# EAGLE board EBookReader (EAGLE 9.7.0)
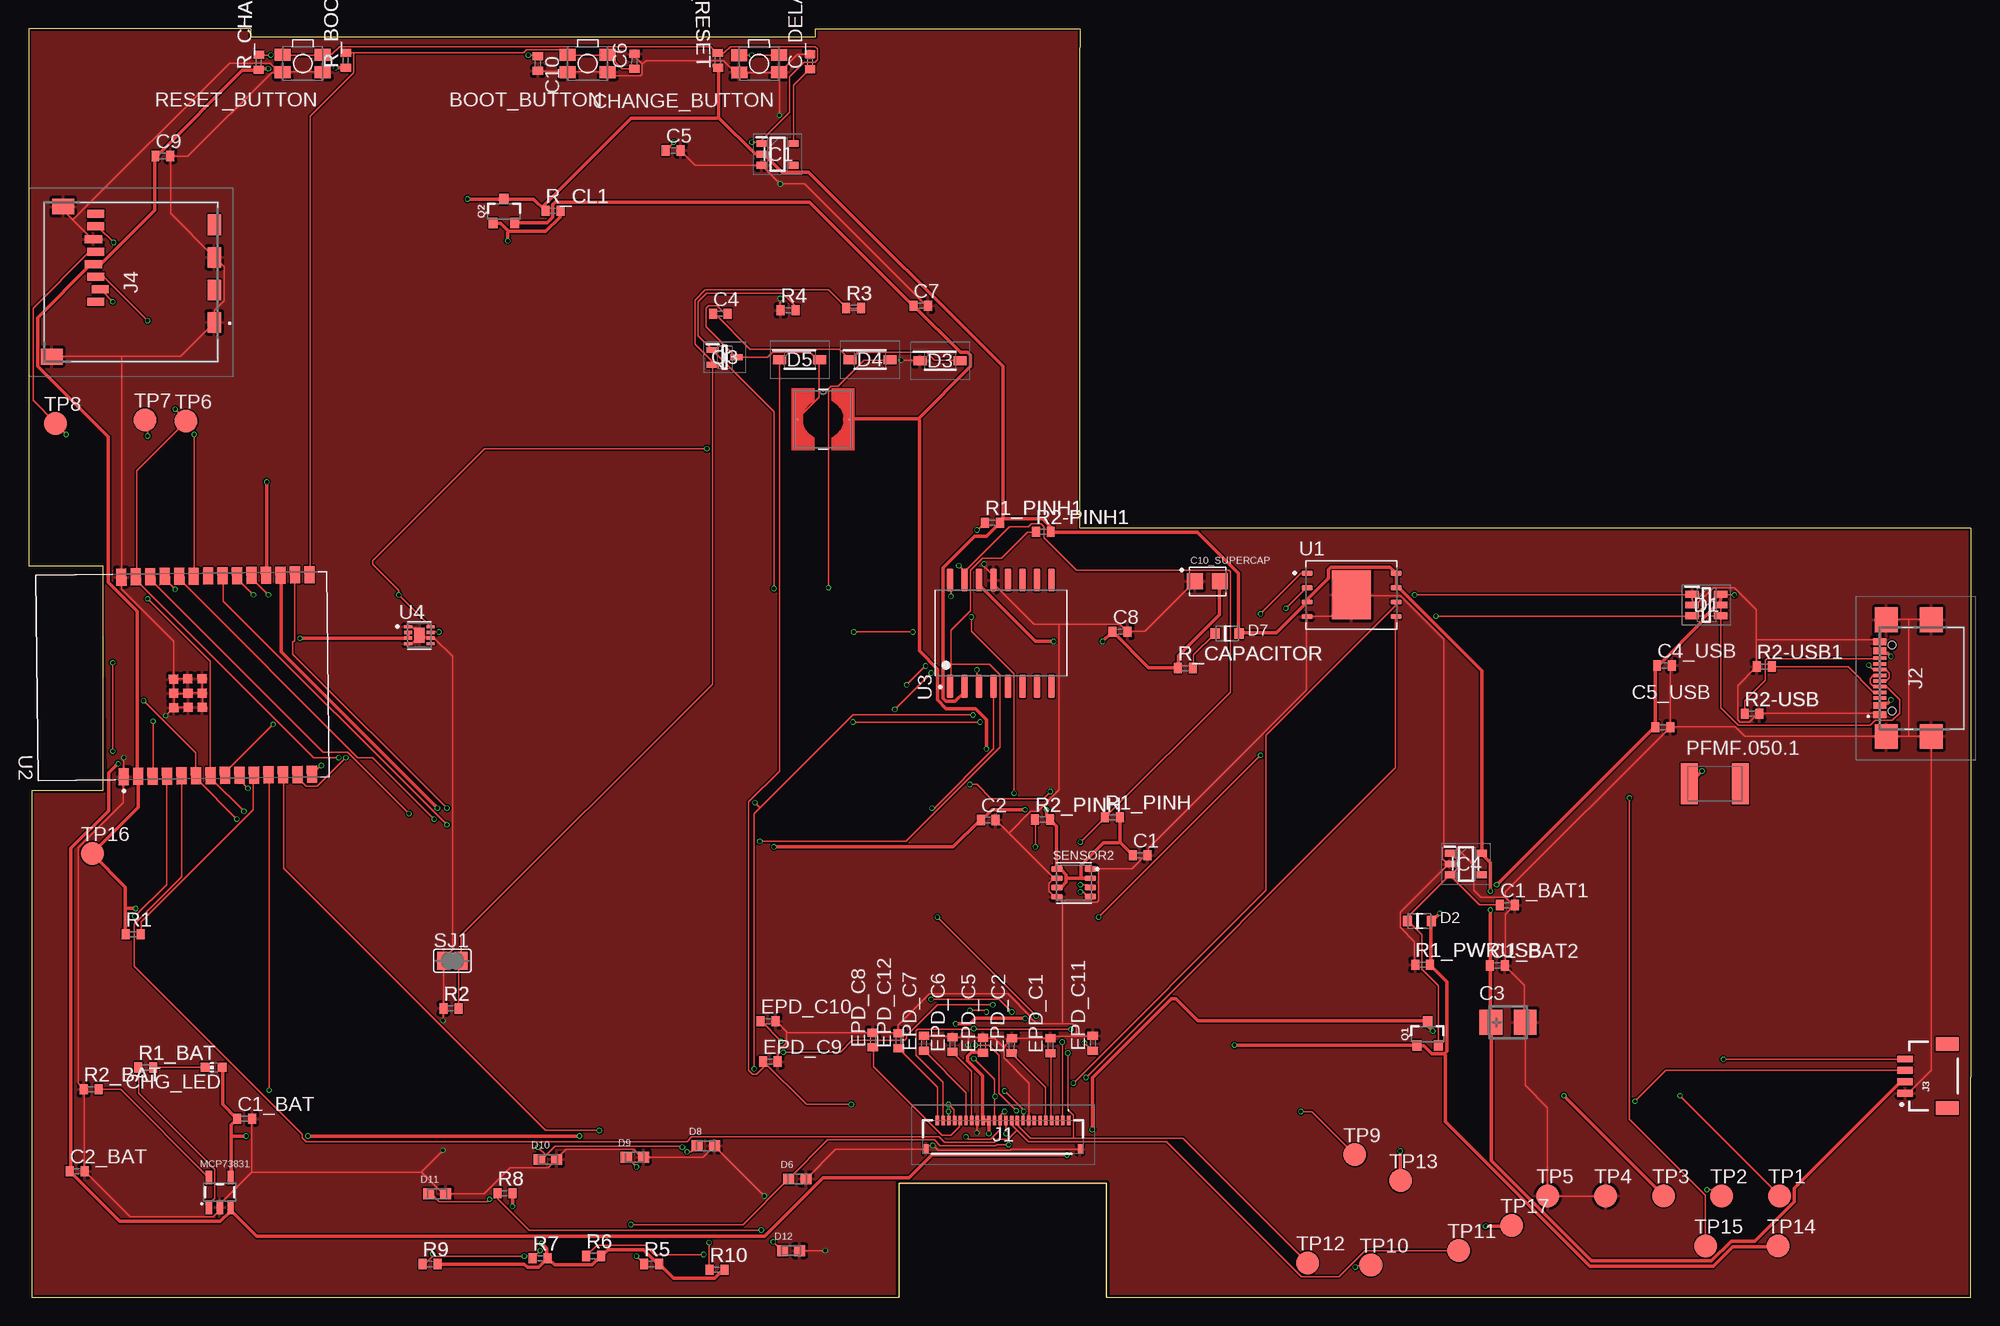
[diagram p1: board, top side]
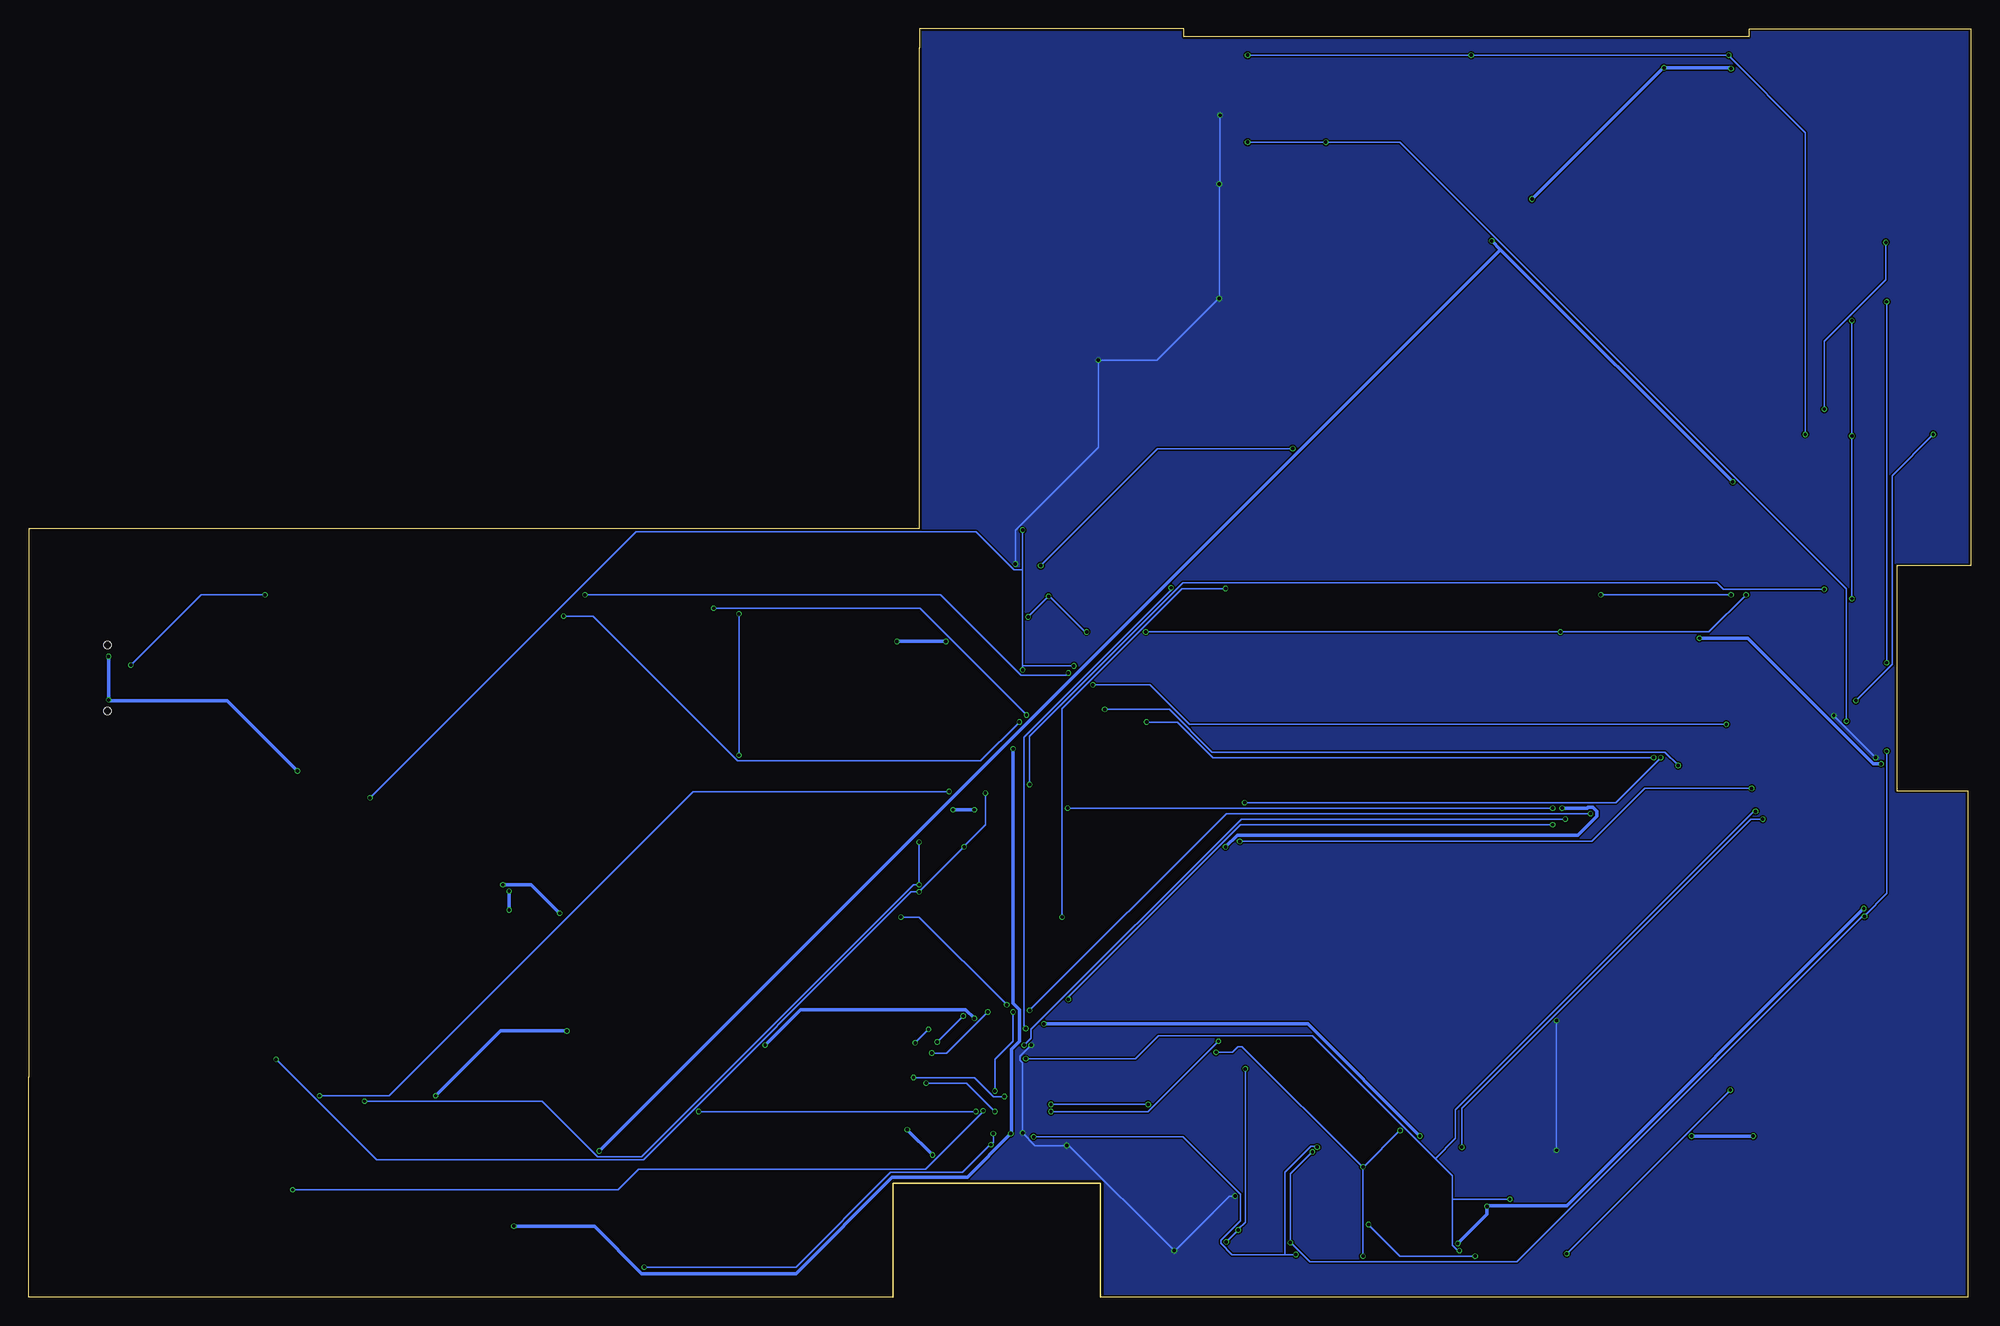
[diagram p2: board, bottom side, seen from below]

Size 170.3 x 111.2 mm. Coordinates in mm from the lower left corner, seen from the top.
Outline: 170.3,0 170.3,19.3 170.3,67.4 92.2,67.4 92.2,109.5 92.2,111.2 69,111.2 69,110.5 19.5,110.5 19.5,111.2 0,111.2 0,64.1 6.5,64.1 6.5,44.4 0.3,44.4 0.3,0 76.3,0 76.3,10 94.5,10 94.5,0 170.3,0
Copper layers (1*16): Top 0.035mm / dielectric 1.6mm / Bottom 0.035mm
Design rules "jlcpcb-2layers.dru": minimum track width 5mil, minimum drill 0.3mm, track to track 5mil, track to pad 5mil, pad to pad 5mil, via to via 5mil, smd to smd 5mil, copper to edge 0.2mm, drill to drill 6mil, minimum pad ring 10mil, minimum via ring 3mil, stop-mask expansion 4mil, vias tented up to drill 0mil, thermal gap 10mil
Net classes: 0 default: width 0.15 mm; 1 power: width 0.3 mm

## Footprints (pad centres in the part's own frame; a part is rotated, then mirrored left to right if it is on the bottom)
MYBUTTON = smd 1.4 x 1.05: 1 1.75,0.75; 2 -1.75,0.75; 3 -1.75,-0.75; 4 1.75,-0.75
EAGLE-LTSPICE_C0402 = smd 0.7 x 0.9: 1 -0.65,0; 2 0.65,0
RCL_CT3528 = smd 2 x 2.2: + -1.5,0; - 1.5,0
CAPCP3225X100N = smd 1.4 x 1.4: 1 -1.1,0; 2 1.1,0
ADAFRUIT_CHIP-LED0603 = smd 0.8 x 0.8: A 0,-0.75; C 0,0.75
SOT95P280X145-6N = smd 1.2 x 0.6: 1 -1.25,0.95; 2 -1.25,0; 3 -1.25,-0.95; 4 1.25,-0.95; 5 1.25,0; 6 1.25,0.95
ESP32_WROVER_AVX---SD0805S020S1R0_AVX_SD0805S020S1R0_0 = smd 0.8 x 0.9: 1 -1.05,0; 2 1.05,0
SOD3716X135N = smd 1.15 x 0.8: 1 -1.75,0; 2 1.75,0
DIOC1608X36N = smd 0.97 x 0.94: 1 -0.75,0; 2 0.75,0
SOT95P280X125-5N = smd 0.9 x 0.6: 1 -1.4,0.95; 2 -1.4,0; 3 -1.4,-0.95; 4 1.4,-0.95; 5 1.4,0.95
SOT95P280X120-5N = smd 0.9 x 0.6: 1 -1.4,0.95; 2 -1.4,0; 3 -1.4,-0.95; 4 1.4,-0.95; 5 1.4,0.95
FH34SRJ24S05SH99 = smd 0.3 x 0.8: 1 5.75,1.45; 2 5.25,1.45; 3 4.75,1.45; 4 4.25,1.45; 5 3.75,1.45; 6 3.25,1.45; 7 2.75,1.45; 8 2.25,1.45; 9 1.75,1.45; 10 1.25,1.45; 11 0.75,1.45; 12 0.25,1.45; 13 -0.25,1.45; 14 -0.75,1.45; 15 -1.25,1.45; 16 -1.75,1.45; 17 -2.25,1.45; 18 -2.75,1.45; 19 -3.25,1.45; 20 -3.75,1.45; 21 -4.25,1.45; 22 -4.75,1.45; 23 -5.25,1.45; 24 -5.75,1.45 | smd 0.4 x 0.8: MP1 6.75,-1.05; MP2 -6.75,-1.05
SAMACSYS_PARTS_USB4110GFA = smd 0.3 x 1.15: A1 -3.35,3.678; A4 -2.55,3.678; A5 -1.25,3.678; A6 -0.25,3.678; A7 0.25,3.678; A8 1.25,3.678; A9 2.55,3.678; A12 3.35,3.678; B1 3.05,3.678; B4 2.25,3.678; B5 1.75,3.678; B6 0.75,3.678; B7 -0.75,3.678; B8 -1.75,3.678; B9 -2.25,3.678; B12 -3.05,3.678 | smd 2.18 x 2: MP1 -5.11,-0.827; MP2 5.11,-0.827; MP3 -5.11,3.103; MP4 5.11,3.103 | hole 0.65: -2.89,2.603; 2.89,2.603
JST04_1MM_RA = smd 0.6 x 1.35: 1 -1.5,0; 2 -0.5,0; 3 0.5,0; 4 1.5,0 | smd 1.2 x 2: NC1 2.8,-3.675; NC2 -2.8,-3.675
112ATAARR03ATTEND = smd 1.8 x 1.2: G1 10.6,10.4; G2 4.9,10.4; S1 7.75,10.4; S2 2.05,10.4 | smd 1.4 x 1.9: G3 13.6,-3.85; G4 0.45,-2.85 | smd 0.7 x 1.5: P1 8.8,0; P2 7.7,0.4; P3 6.6,0; P4 5.5,-0.2; P5 4.4,0; P6 3.3,-0.2; P7 2.2,0; P8 1.1,0
IND_4828-WE-TPC_WRE = smd 0.127 x 0.127: 1 -2.286,0; 2 2.286,0
ESP32_WROVER_SPARKFUN-IC-POWER_SOT23-5 = smd 0.55 x 1.2: 1 -0.95,-1.3; 2 0,-1.3; 3 0.95,-1.3; 4 0.95,1.3; 5 -0.95,1.3
ESP32C6_VARISTOR_CT/CN1812 = smd 1.5 x 3.6: 1 -2.25,0; 2 2.25,0
ESP32_WROVER_SPARKFUN-DISCRETESEMI_SOT23-3 = smd 0.8 x 0.9: 1 -0.95,-1; 2 0.95,-1; 3 0,1.1
SOT65P210X110-3N = smd 1.05 x 0.5: 1 -1.05,0.65; 2 -1.05,-0.65; 3 1.05,0
ESP32_WROVER_EAGLE-LTSPICE_R0402 = smd 0.7 x 0.9: 1 -0.65,0; 2 0.65,0
ESP32_WROVER_BME680_PSON80P300X300X100-8N = smd 1.016 x 0.5: 1 1.458,1.2; 2 1.458,0.4; 3 1.458,-0.4; 4 1.458,-1.2; 5 -1.458,-1.22; 6 -1.458,-0.4; 7 -1.458,0.4; 8 -1.458,1.2
SJ = smd 1.168 x 1.6: 1 -0.762,0; 2 0.762,0
TP20R = smd 2 x 2: TP 0,0
SON127P600X800X80-9N = smd 0.94 x 0.44: 1 -3.895,1.905; 2 -3.895,0.635; 3 -3.895,-0.635; 4 -3.895,-1.905; 5 3.895,-1.905; 6 3.895,-0.635; 7 3.895,0.635; 8 3.895,1.905 | smd 3.4 x 4.3: 9 0,0
XCVR_ESP32-C6-WROOM-1-N8 = smd 1.5 x 0.9: 1 -8.75,5.26; 2 -8.75,3.99; 3 -8.75,2.72; 4 -8.75,1.45; 5 -8.75,0.18; 6 -8.75,-1.09; 7 -8.75,-2.36; 8 -8.75,-3.63; 9 -8.75,-4.9; 10 -8.75,-6.17; 11 -8.75,-7.44; 12 -8.75,-8.71; 13 -8.75,-9.98; 14 -8.75,-11.25; 15 8.75,-11.25; 16 8.75,-9.98; 17 8.75,-8.71; 18 8.75,-7.44; 19 8.75,-6.17; 20 8.75,-4.9; 21 8.75,-3.63; 22 8.75,-2.36; 23 8.75,-1.09; 24 8.75,0.18; 25 8.75,1.45; 26 8.75,2.72; 27 8.75,3.99; 28 8.75,5.26 | smd 0.8 x 0.8: 29_1 -2.755,0.79; 29_2 -1.505,0.79; 29_3 -0.255,0.79; 29_4 -2.755,-0.46; 29_5 -1.505,-0.46; 29_6 -0.255,-0.46; 29_7 -2.755,-1.71; 29_8 -1.505,-1.71; 29_9 -0.255,-1.71
SOIC127P1032X265-16N = smd 2.05 x 0.59: 1 -4.655,4.445; 2 -4.655,3.175; 3 -4.655,1.905; 4 -4.655,0.635; 5 -4.655,-0.635; 6 -4.655,-1.905; 7 -4.655,-3.175; 8 -4.655,-4.445; 9 4.655,-4.445; 10 4.655,-3.175; 11 4.655,-1.905; 12 4.655,-0.635; 13 4.655,0.635; 14 4.655,1.905; 15 4.655,3.175; 16 4.655,4.445
SON50P200X200X80-9N = smd 0.76 x 0.27: 1 -0.985,0.75; 2 -0.985,0.25; 3 -0.985,-0.25; 4 -0.985,-0.75; 5 0.985,-0.75; 6 0.985,-0.25; 7 0.985,0.25; 8 0.985,0.75 | smd 0.9 x 1.3: 9 0,0

## Placement (x,y rotation side)
BOOT_BUTTON  BUTTON_CUSYOMV1  [MYBUTTON]  49.03,108.13 180 top
C1  100nF  [EAGLE-LTSPICE_C0402]  97.46,38.73 0 top
C1_BAT  4.7uF  [EAGLE-LTSPICE_C0402]  18.95,15.65 0 top
C1_BAT1  4.7uF  [EAGLE-LTSPICE_C0402]  129.65,34.37 0 top
C1_BAT2  4.7uF  [EAGLE-LTSPICE_C0402]  128.79,29.07 0 top
C2  100nF  [EAGLE-LTSPICE_C0402]  84.14,41.83 0 top
C2_BAT  4.7uF  [EAGLE-LTSPICE_C0402]  4.26,11.05 0 top
C3  100uF TANT  [RCL_CT3528]  129.71,24.1 0 top
C4  4.7uF/25V  [EAGLE-LTSPICE_C0402]  60.65,86.19 0 top
C4_USB  100nF  [EAGLE-LTSPICE_C0402]  143.43,55.37 0 top
C5  1uF  [EAGLE-LTSPICE_C0402]  56.52,100.51 0 top
C5_USB  4.7uF  [EAGLE-LTSPICE_C0402]  143.28,49.95 0 top
C6  100nF  [EAGLE-LTSPICE_C0402]  53.12,108.33 89.5 top
C7  10uF  [EAGLE-LTSPICE_C0402]  78.22,86.91 0 top
C8  100nF  [EAGLE-LTSPICE_C0402]  95.7,58.33 0 top
C9  100nF  [EAGLE-LTSPICE_C0402]  11.78,100.03 0 top
C10  100nF  [EAGLE-LTSPICE_C0402]  44.66,108.13 270 top
C10_SUPERCAP  CPH3225A  [CAPCP3225X100N]  103.36,62.74 0 top
C_DELAY  100nF  [EAGLE-LTSPICE_C0402]  68.51,108.29 90 top
CHANGE_BUTTON  BUTTON_CUSYOMV1  [MYBUTTON]  64.06,108.11 180.5 top
CHG_LED  [ADAFRUIT_CHIP-LED0603]  16.24,20.15 90 top
D1  USBLC6-2SC6Y  [SOT95P280X145-6N]  147.1,60.67 0 top
D2  ESP32_WROVER_AVX---SD0805S020S1R0_AVX_SD0805S020S1R0_0_0AVX_SD0805S020S1R0_0_0  [ESP32_WROVER_AVX---SD0805S020S1R0_AVX_SD0805S020S1R0_0]  121.94,32.98 0 top
D3  MBR0530  [SOD3716X135N]  79.93,82.08 0 top
D4  MBR0530  [SOD3716X135N]  73.77,82.18 0 top
D5  MBR0530  [SOD3716X135N]  67.61,82.18 0 top
D6  PGB1010603MR  [DIOC1608X36N]  67.4,10.37 0 top
D7  ESP32_WROVER_AVX---SD0805S020S1R0_AVX_SD0805S020S1R0_0_0AVX_SD0805S020S1R0_0_0  [ESP32_WROVER_AVX---SD0805S020S1R0_AVX_SD0805S020S1R0_0]  105.09,58.18 0 top
D8  PGB1010603MR  [DIOC1608X36N]  59.38,13.27 0 top
D9  PGB1010603MR  [DIOC1608X36N]  53.16,12.27 0 top
D10  PGB1010603MR  [DIOC1608X36N]  45.54,12.07 0 top
D11  PGB1010603MR  [DIOC1608X36N]  35.82,9.07 0 top
D12  PGB1010603MR  [DIOC1608X36N]  66.85,4.08 0 top
EPD_C1  1uF/50V  [EAGLE-LTSPICE_C0402]  89.59,22.05 90 top
EPD_C2  1uF/50V  [EAGLE-LTSPICE_C0402]  86.2,22.05 88.9 top
EPD_C5  0.1uF/50V  [EAGLE-LTSPICE_C0402]  83.69,22.09 90 top
EPD_C6  1uF/50V  [EAGLE-LTSPICE_C0402]  81.01,22.15 90 top
EPD_C7  1uF/50V  [EAGLE-LTSPICE_C0402]  78.52,22.25 90 top
EPD_C8  1uF/50V  [EAGLE-LTSPICE_C0402]  74.03,22.55 90 top
EPD_C9  1uF/50V  [EAGLE-LTSPICE_C0402]  65.04,20.65 0 top
EPD_C10  1uF/50V  [EAGLE-LTSPICE_C0402]  64.85,24.19 0 top
EPD_C11  1uF/50V  [EAGLE-LTSPICE_C0402]  93.31,22.27 90 top
EPD_C12  1uF/50V  [EAGLE-LTSPICE_C0402]  76.29,22.49 90 top
IC1  BD5229G-TR  [SOT95P280X125-5N]  65.67,100.17 0 top
IC4  XC6220A331MR-G  [SOT95P280X120-5N]  126.01,37.97 0 top
J1  FH34SRJ-24S-0.5SH_99_  [FH34SRJ24S05SH99]  85.44,14.04 0 top
J2  SAMACSYS_PARTS_USB4110-GF-A  [SAMACSYS_PARTS_USB4110GFA]  165.98,54.26 90 top
J3  QWIIC_RIGHT_ANGLE  [JST04_1MM_RA]  164.53,19.38 90 top
J4  112A-TAAR-R03_ATTEND  [112ATAARR03ATTEND]  5.89,96.05 270 top
L1  68uH  [IND_4828-WE-TPC_WRE]  69.67,76.95 0 top
MCP73831  ESP32_WROVER_SPARKFUN-IC-POWER_MCP73831  [ESP32_WROVER_SPARKFUN-IC-POWER_SOT23-5]  16.78,9.19 0 top
PFMF.050.1  ESP32C6_VARISTORCN1812  [ESP32C6_VARISTOR_CT/CN1812]  147.84,45 0 top
Q1  20V/4.2A/52mΩ/1.4W  [ESP32_WROVER_SPARKFUN-DISCRETESEMI_SOT23-3]  122.66,23.06 0 top
Q2  20V/4.2A/52mΩ/1.4W  [ESP32_WROVER_SPARKFUN-DISCRETESEMI_SOT23-3]  41.68,95.16 0 top
Q3  SI1308EDL-T1-GE3  [SOT65P210X110-3N]  61.04,82.38 0 top
R1  10K  [ESP32_WROVER_EAGLE-LTSPICE_R0402]  9.18,31.81 0 top
R1_BAT  200  [ESP32_WROVER_EAGLE-LTSPICE_R0402]  10.28,20.13 0 top
R1_PINH  10K  [ESP32_WROVER_EAGLE-LTSPICE_R0402]  95.03,42.07 0 top
R1_PINH1  10K  [ESP32_WROVER_EAGLE-LTSPICE_R0402]  84.51,67.89 0 top
R1_PWRUSB  100K  [ESP32_WROVER_EAGLE-LTSPICE_R0402]  122.22,29.14 0 top
R2  2.2  [ESP32_WROVER_EAGLE-LTSPICE_R0402]  37.04,25.31 0 top
R2-PINH1  10K  [ESP32_WROVER_EAGLE-LTSPICE_R0402]  88.97,67.09 0 top
R2-USB  5K1  [ESP32_WROVER_EAGLE-LTSPICE_R0402]  151.1,51.13 0 top
R2-USB1  5K1  [ESP32_WROVER_EAGLE-LTSPICE_R0402]  152.17,55.27 0 top
R2_BAT  2K  [ESP32_WROVER_EAGLE-LTSPICE_R0402]  5.49,18.23 0 top
R2_PINH  10K  [ESP32_WROVER_EAGLE-LTSPICE_R0402]  88.91,41.87 0 top
R3  0.47  [ESP32_WROVER_EAGLE-LTSPICE_R0402]  72.34,86.71 0 top
R4  10K  [ESP32_WROVER_EAGLE-LTSPICE_R0402]  66.6,86.51 0 top
R5  10K  [ESP32_WROVER_EAGLE-LTSPICE_R0402]  54.62,2.91 0 top
R6  10K  [ESP32_WROVER_EAGLE-LTSPICE_R0402]  49.54,3.61 0 top
R7  10K  [ESP32_WROVER_EAGLE-LTSPICE_R0402]  44.86,3.41 0 top
R8  10K  [ESP32_WROVER_EAGLE-LTSPICE_R0402]  41.78,9.11 0 top
R9  10K  [ESP32_WROVER_EAGLE-LTSPICE_R0402]  35.2,2.91 0 top
R10  10K  [ESP32_WROVER_EAGLE-LTSPICE_R0402]  60.36,2.41 0 top
R_BOOT  10K  [ESP32_WROVER_EAGLE-LTSPICE_R0402]  27.82,108.41 90 top
R_CAPACITOR  15  [ESP32_WROVER_EAGLE-LTSPICE_R0402]  101.42,55.14 0 top
R_CHANGE  10K  [ESP32_WROVER_EAGLE-LTSPICE_R0402]  20.19,108.24 88.9 top
R_CL1  10K  [ESP32_WROVER_EAGLE-LTSPICE_R0402]  45.98,95.23 0 top
R_RESET  10K  [ESP32_WROVER_EAGLE-LTSPICE_R0402]  60.43,108.4 91.1 top
RESET_BUTTON  BUTTON_CUSYOMV1  [MYBUTTON]  24.05,108.13 180 top
SENSOR2  ESP32_WROVER_BME680_BME680  [ESP32_WROVER_BME680_PSON80P300X300X100-8N]  91.64,36.32 0 top
SJ1  [SJ]  37.16,29.49 0 top
TP1  TPTP20R  [TP20R]  153.51,8.89 0 top
TP2  TPTP20R  [TP20R]  148.43,8.89 0 top
TP3  TPTP20R  [TP20R]  143.35,8.89 0 top
TP4  TPTP20R  [TP20R]  138.27,8.89 0 top
TP5  TPTP20R  [TP20R]  133.19,8.89 0 top
TP6  TPTP20R  [TP20R]  13.81,76.79 0 top
TP7  TPTP20R  [TP20R]  10.23,76.89 0 top
TP8  TPTP20R  [TP20R]  2.35,76.59 0 top
TP9  TPTP20R  [TP20R]  116.27,12.49 0 top
TP10  TPTP20R  [TP20R]  117.69,2.81 0 top
TP11  TPTP20R  [TP20R]  125.39,4.09 0 top
TP12  TPTP20R  [TP20R]  112.14,3.01 0 top
TP13  TPTP20R  [TP20R]  120.29,10.21 0 top
TP14  TPTP20R  [TP20R]  153.39,4.49 0 top
TP15  TPTP20R  [TP20R]  147.04,4.49 0 top
TP16  TPTP20R  [TP20R]  5.59,38.89 0 top
TP17  TPTP20R  [TP20R]  130.04,6.29 0 top
U1  W25Q512JVEIQ  [SON127P600X800X80-9N]  115.99,61.56 0 top
U2  ESP32-C6-WROOM-1-N8  [XCVR_ESP32-C6-WROOM-1-N8]  13.5,54.44 90.7 top
U3  DS3231SN#  [SOIC127P1032X265-16N]  85.25,58.2 90 top
U4  MAX17048G+T10  [SON50P200X200X80-9N]  34.27,58.02 0 top

## Tracks (layer width: path | path; a pad name or v marks a point on that pad's centre or on a via)
3V3  (via drill 0.3)
  Top 0.3: J3.2 164.52,18.84 164.1,18.84 154.83,9.56 154.83,8.38 151.36,4.92 149.29,4.92 147.55,3.19 137.03,3.19 128.23,11.98 128.23,23.96 C3.+ 128.16,24.17 128.16,29.02 C1_BAT2.1 128.16,29.15 v128.16,33.93 | 85.51,68.21 88.9,68.21 89.59,67.52 89.59,67.1 R2-PINH1.2 89.73,67.03 102.47,67.03 106.07,63.43 106.07,58.38 D7.2 106.14,58.24 109.4,58.24 112.03,60.87 U1.3 112.17,61.01 112.17,61.22 113.97,63.02 113.97,63.78 114.17,63.99 119.37,63.99 119.78,63.57 U1.8 119.92,63.43 119.92,62.33 U1.7 119.92,62.19 120.13,62.19 127.4,54.91 127.4,38.99 IC4.5 127.47,38.78 128.16,38.09 v128.16,35.59 | 85.51,68.21 85.23,67.93 R1_PINH1.2 85.09,67.8 83.98,66.69 82.94,66.69 80.17,63.92 80.17,52.49 80.45,52.22 81.21,52.22 82.04,53.05 82.04,53.53 U3.2 | 60.51,103.39 63.69,100.2 64.25,100.2 IC1.2 64.38,100.27 66.05,98.61 68.4,98.61 85.44,81.58 85.44,68.35 85.51,68.21 | 60.51,103.39 60.51,107.68 R_RESET.1 | 60.51,103.39 60.37,103.32 52.82,103.32 45.13,95.63 R_CL1.1 45.27,95.29 44.3,96.26 41.74,96.26 Q2.3 41.53,96.26 v38.48,96.26 | R9.2 43.47,2.91 43.75,2.63 44.72,2.63 45.48,3.39 R7.2 | v42.43,7.96 42.43,9.07 R8.2 | v44.99,4.71 45.41,4.29 45.41,3.53 R7.2 | R7.2 45.62,3.32 46.1,2.84 49.43,2.84 R6.2 50.33,3.67 50.81,4.16 53.93,4.16 55.11,2.98 55.24,2.98 R5.2 55.38,2.84 56.56,1.66 60.16,1.66 60.85,2.35 60.99,2.35 R10.2 | 8.5,34.07 8.5,35.94 5.59,38.85 TP16.TP 5.66,38.99 9.61,42.94 9.61,45.64 U2.2 9.54,45.77 9.54,60.11 6.98,62.67 6.98,75.41 0.81,81.58 0.81,85.87 5.38,90.44 5.59,90.44 J4.P4 5.73,90.58 6.35,90.58 11.06,95.29 11.06,100 C9.1 11.27,100.07 18.75,107.55 20.13,107.55 R_CHANGE.1 20.27,107.68 v21.03,107.68
  Top 0.3: 8.5,34.07 8.5,31.86 R1.1 | v26.92,107.75 27.75,107.75 R_BOOT.1 | 8.5,34.07 v9.4,34.07
  Bottom 0.3: v128.16,35.59 v128.16,33.93 | v44.99,4.71 42.43,7.27 v42.43,7.96 42.29,8.03 35.44,8.03 v9.4,34.07 | v21.03,107.68 21.1,107.75 v26.92,107.75 27.06,107.68 v38.48,96.26
32KHZ  (via drill 0.3)
  Top 0.15: 80.87,55.47 80.87,53.6 U3.1 | 80.87,55.47 80.87,58.45 82.6,60.18 82.6,63.71 83.64,64.75 85.3,64.75 87.58,67.03 88.27,67.03 R2-PINH1.1 | v19.23,44.6 18.54,45.29 18.54,45.7 U2.9 | v64.11,39.96 76.92,39.96 85.16,48.2 85.16,54.57 84.26,55.47 80.87,55.47
  Bottom 0.15: v19.23,44.6 28.58,44.6 33.22,39.96 v64.11,39.96
DN
  Top 0.15: J2.A7 162.24,54.5 161.75,54.5 161.47,54.22 161.47,53.81 161.75,53.53 162.24,53.53 J2.B7 162.37,53.53 162.86,53.53 164.04,52.35 164.04,51.18 163.41,50.55 161.89,50.55 161.47,50.14 149.91,50.14 148.38,51.66 148.38,59.69 D1.5
DP  (via drill 0.3)
  Top 0.15: J2.A6 162.86,54.02 163.14,54.29 163.14,54.71 162.86,54.98 162.3,54.98 J2.B6 162.24,55.05 161.68,55.05 v161.33,55.4 | v149.56,61.56 148.38,61.56 D1.3
  Bottom 0.15: v149.56,61.56 155.17,61.56 v161.33,55.4
EPD_3V3  (via drill 0.3)
  Top 0.3: 78.03,77.01 82.6,81.58 82.6,82.55 82.32,82.82 81.7,82.82 77.61,86.91 C7.1 77.47,86.98 68.47,95.98 46.17,95.98 45.96,95.77 45.96,94.67 45.48,94.18 42.64,94.18 Q2.2 | 78.03,77.01 72,77.01 L1.2 | EPD_C5.1 83.64,21.47 82.67,21.47 82.32,21.12 82.32,20.71 83.64,19.39 83.64,15.65 J1.16 83.7,15.51 84.19,15.51 J1.15 84.19,15.37 v84.19,14.34 | v127.75,6.23 130.03,6.23 TP17.TP | v83.98,48.06 83.98,50.62 83.01,51.59 80.45,51.59 79.69,52.35 79.69,55.05 78.1,56.65 78.1,76.87 78.03,77.01
  Bottom 0.3: v127.75,6.23 120.69,6.23 116.53,2.08 103.03,2.08 94.58,10.53 88,10.53 v84.19,14.34 84.12,14.47 84.12,21.74 83.43,22.44 83.43,25.21 83.98,25.76 v83.98,48.06
EPD_3V3_C  (via drill 0.3)
  Top 0.3: 42.09,93.42 41.39,94.11 40.77,94.11 Q2.1 | 42.09,93.42 45.34,93.42 46.59,94.67 46.59,95.22 R_CL1.2 | v20.9,71.47 20.9,63.29 U2.18 | v42.02,92.59 42.02,93.28 42.09,93.42 | v120.27,12.81 120.27,10.25 TP13.TP
  Bottom 0.3: v42.02,92.59 41.25,91.83 | 41.25,91.83 v20.9,71.47 | 41.25,91.83 v120.27,12.81
EPD_BUSY  (via drill 0.3)
  Top 0.15: v111.54,16.27 112.51,16.27 116.25,12.53 TP9.TP | J1.9 87.24,15.51 v87.24,16.27 87.24,16.41 v85.58,18.07 | v33.36,42.38 27.96,47.78 25.81,47.78 10.71,62.88 10.71,63.16 U2.26 | v82.53,25.14 83.84,25.14 v83.98,25
  Bottom 0.15: v111.54,16.27 v87.24,16.27 | v33.36,42.38 65.28,42.38 v82.53,25.14 | v83.98,25 83.98,22.44 85.58,20.84 v85.58,18.07
EPD_CS  (via drill 0.3)
  Top 0.15: v85.71,14.34 85.71,15.44 J1.12 | v85.92,13.37 84.88,13.37 84.81,13.3 79.9,13.3 79.41,13.78 70.06,13.78 66.67,10.39 D6.1 66.6,10.32 62.65,6.37 v52.82,6.37 | 35.44,3.6 34.81,2.98 34.61,2.98 R9.1 | v43.47,3.6 35.44,3.6 | v21.1,18.14 21.1,45.77 U2.11 | 35.44,3.6 v35.44,3.81 | v116.32,2.63 116.46,2.77 117.64,2.77 TP10.TP
  Bottom 0.15: v85.71,14.34 85.71,13.57 v85.92,13.37 85.99,13.37 88.41,10.94 94.72,10.94 103.03,2.63 v116.32,2.63 | v43.47,3.6 50.05,3.6 v52.82,6.37 | v35.44,3.81 v21.1,18.14
EPD_DC
  Top 0.15: 86.65,14.65 87.65,13.64 99.77,13.64 111.61,1.8 114.87,1.8 117.15,4.09 125.32,4.09 TP11.TP | 86.65,14.65 86.2,15.1 86.2,15.44 J1.11 | 86.65,14.65 85.85,13.85 84.95,13.85 84.67,13.57 80.31,13.57 79.83,14.06 58.15,14.06 57.74,13.64 24.36,13.64 24.01,13.99 24.01,14.27 9.26,29.02 9.26,32.69 13.42,36.84 13.42,45.64 U2.5
EPD_RST  (via drill 0.3)
  Top 0.15: 91.6,13.92 101.22,13.92 112.1,3.05 TP12.TP | 91.6,13.92 87.86,13.92 86.75,15.03 86.75,15.44 J1.10 | v36.68,41.41 17.09,61.01 17.09,63.23 U2.21 | v79.13,26.11 85.09,26.11 v86.2,25 | v91.11,21.4 91.11,16.41 91.6,15.93 91.6,13.92
  Bottom 0.15: v36.68,41.41 64.04,41.41 79.13,26.32 v79.13,26.11 | v86.2,25 89.8,21.4 v91.11,21.4
FLASH_CS  (via drill 0.3)
  Top 0.15: v53.3,3.6 53.93,2.98 R5.1 | v53.3,11.43 52.47,12.26 D9.1 | v108.01,59.9 111.54,63.43 112.03,63.43 U1.1 | v93.82,33.31 v108.01,47.51 | v84.54,25.62 79.69,25.62 76.99,22.92 76.99,22.71 76.78,22.51 72.21,22.51 71.17,21.47 v66.19,21.47 | v50.05,14.61 45.34,14.61 22.35,37.6 22.35,45.77 U2.12
  Bottom 0.15: v53.3,11.43 v53.3,3.6 | v108.01,47.51 v108.01,59.9 | v93.82,33.31 92.22,33.31 v84.54,25.62 | v66.19,21.47 64.73,21.47 64.25,21.95 63.9,21.95 53.37,11.43 v53.3,11.43 | v50.05,14.61 53.23,11.43 v53.3,11.43
GDR  (via drill 0.3)
  Top 0.15: v90.63,22.37 90.63,15.51 J1.2 | v79.69,33.31 v88.34,24.65 | v65.35,62.12 65.35,77.63 60.02,82.96 Q3.1 59.95,83.03 58.71,84.28 58.71,87.25 59.47,88.02 66.12,88.02 67.22,86.91 67.22,86.56 R4.2
  Bottom 0.15: v88.34,24.65 v90.63,22.37 | v79.69,33.31 79.69,51.59 69.16,62.12 v65.35,62.12
GND  (via drill 0.3)
  Top 0.15: U2.29_3 12.72,54.22 13.9,54.22 U2.29_6 | U2.29_2 12.72,52.98 12.72,54.15 U2.29_3 | U2.29_1 12.79,51.73 12.79,52.91 U2.29_2 | U2.29_2 12.86,52.91 13.97,52.91 U2.29_5 14.04,52.98 15.22,52.98 U2.29_8 | U2.29_4 13.97,51.73 12.86,51.73 U2.29_1 | U2.29_7 15.29,51.73 15.29,52.91 U2.29_8 | U2.29_9 15.22,54.15 15.22,53.05 U2.29_8 | U2.29_3 12.72,54.29 12.72,57.48 8.15,62.05 8.15,63.09 U2.28 8.15,63.16 8.15,82.48 | 3.89,94.42 3.1,95.22 3.1,95.56 J4.G4 | 3.89,94.42 5.52,92.8 5.66,92.8 J4.P6 | RESET_BUTTON.2 25.74,107.41 22.35,107.41 RESET_BUTTON.1 22.28,107.34 21.52,107.34 | 8.15,82.48 13.35,82.48 16.26,85.39 J4.G1 16.33,85.45 16.33,86.49 17.16,87.32 17.16,90.3 16.33,91.13 J4.G2 16.26,91.2 12.45,95.01 12.45,100 C9.2 12.52,100 13.97,100 21.31,107.34 21.52,107.34 | 8.15,82.48 2.06,82.48 J4.G3 | 3.89,94.42 17.64,108.17 21.17,108.17 21.52,107.82 21.52,107.34 | U4.4 33.29,57.34 33.64,57.34 34.26,57.96 U4.9 | U4.9 34.33,57.96 34.47,57.82 35.23,57.82 U4.6 35.3,57.76 35.58,57.76 37.17,56.16 37.17,30.47 36.41,29.71 SJ1.1 36.41,29.43 36.41,25.35 R2.1 36.34,25.28 v36.34,24.24 | U4.1 33.29,58.72 33.64,58.72 34.33,58.03 U4.9 | 19.58,10.94 19.58,15.58 C1_BAT.2 | 19.58,10.94 16.81,8.17 16.81,7.89 MCP73831.2 16.74,7.83 16.74,7.62 16.19,7.06 8.92,7.06 4.97,11.01 C2_BAT.2 4.9,11.08 4.9,18.21 R2_BAT.1 4.83,18.28 4.35,18.77 4.35,39.4 8.29,43.35 8.29,45.57 U2.1 v8.36,47.3 | 34.47,10.94 36.27,9.14 36.55,9.14 D11.2 36.62,9.07 39.94,9.07 42.22,11.36 45.55,11.36 46.24,12.05 D10.2 46.31,12.12 47.14,12.95 53.03,12.95 53.65,12.33 53.86,12.33 D9.2 53.93,12.26 59.12,12.26 60.09,13.23 D8.2 60.16,13.23 v64.52,8.86
  Top 0.15: 19.58,10.94 34.47,10.94 | v36.34,12.88 34.47,11.01 34.47,10.94 | v12.03,50.97 12.72,51.66 U2.29_1 | R1_PWRUSB.1 121.52,29.15 121.52,31.16 120.27,32.41 120.27,33.73 124.56,38.02 IC4.2 124.42,37.95 123.94,38.43 123.94,39.33 124.08,39.47 | TP4.TP 138.21,8.86 133.22,8.86 TP5.TP 133.15,8.93 133.15,16.62 131.21,18.56 131.21,24.03 C3.- 131.14,24.17 131.14,27.35 129.48,29.02 C1_BAT2.2 129.48,29.09 129.48,33.59 130.24,34.35 C1_BAT1.2 130.17,34.35 129.48,35.04 | 124.08,39.47 125.12,39.47 126.71,37.88 126.71,35.66 127.33,35.04 129.48,35.04 | J2.A1 162.3,50.97 162.3,51.18 J2.B12 162.24,51.18 151.78,51.18 R2-USB.2 151.71,51.11 151.57,51.11 150.88,50.41 150.05,50.41 149.84,50.62 149.84,53.6 151.5,55.26 R2-USB1.1 151.5,55.33 151.5,57.62 | 151.5,57.62 151.5,60.25 149.56,62.19 147.69,62.19 146.24,60.73 145.89,60.73 D1.1 | J2.B1 162.3,57.34 162.3,57.55 J2.A12 | J2.A12 162.37,57.62 162.37,58.86 162.86,59.35 J2.MP4 162.93,59.42 164.87,59.42 | 164.87,59.42 166.81,59.42 J2.MP2 | C5_USB.2 143.95,50 143.95,55.26 144.02,55.33 C4_USB.2 | J3.1 164.59,17.94 164.87,17.94 166.81,19.88 166.81,49.1 J2.MP1 166.74,49.17 164.87,49.17 | 164.87,49.17 162.93,49.17 J2.MP3 162.86,49.17 150.46,49.17 149.63,50 144.02,50 C5_USB.2 | 164.87,49.17 164.87,59.42 | 151.5,57.62 162.24,57.62 J2.A12 | 129.48,35.04 129.48,35.52 143.88,49.93 C5_USB.2 | C_DELAY.2 68.47,108.93 67.43,108.93 65.84,107.34 CHANGE_BUTTON.2 | CHANGE_BUTTON.2 65.77,107.34 62.38,107.34 CHANGE_BUTTON.1 62.31,107.41 61.89,107.41 60.92,108.38 54.14,108.38 53.86,108.1 53.79,108.1 | C10.2 44.72,107.48 47.21,107.48 47.28,107.41 BOOT_BUTTON.1 47.35,107.41 50.74,107.41 BOOT_BUTTON.2 50.81,107.34 51.09,107.06 53.65,107.06 53.79,107.2 53.79,108.1
  Top 0.15: 53.79,108.1 53.17,108.72 53.17,108.93 C6.2 | C5.2 57.18,100.48 58.43,99.23 64.25,99.23 IC1.3 64.31,99.17 v65.91,97.57 68.06,97.57 78.65,86.98 78.86,86.98 C7.2 | v65.91,87.53 65.91,86.56 R4.1 | v76.5,82.13 78.16,82.13 D3.1 | v65.84,103.6 65.84,107.27 CHANGE_BUTTON.2 | D6.2 68.19,10.39 70.75,12.95 78.65,12.95 J1.MP2 79,13.3 v79.27,13.3 79.34,13.3 79.76,12.88 86.06,12.88 86.13,12.95 92.15,12.95 J1.MP1 | v83.15,14.4 83.15,15.44 J1.17 | v69.86,4.09 67.64,4.09 D12.2 | 66.46,23.2 66.46,23.27 65.56,24.17 EPD_C10.2 | 66.46,23.2 66.46,22.3 66.12,21.95 66.05,21.95 65.7,21.61 65.7,20.71 EPD_C9.2 | 66.46,23.2 74.01,23.2 EPD_C8.2 74.08,23.2 76.23,23.2 EPD_C12.2 76.23,23.27 76.23,23.82 79,26.59 85.85,26.59 87.86,24.58 87.86,24.52 88.41,23.96 90.63,23.96 | EPD_C7.2 78.58,22.85 81,22.85 EPD_C6.2 81.07,22.78 82.39,22.78 | 85.51,21.95 85.51,20.98 87.72,18.77 87.72,15.51 J1.8 | 85.51,21.95 86.2,22.64 EPD_C2.2 86.27,22.71 89.52,22.71 EPD_C1.2 89.66,22.71 89.8,22.85 91.88,22.85 | 85.51,21.95 85.44,21.95 84.67,22.71 83.7,22.71 EPD_C5.2 83.64,22.78 82.39,22.78 | 91.88,22.85 93.26,22.85 EPD_C11.2 | 90.63,23.96 91.53,23.96 91.88,23.61 91.88,22.85 | 82.39,22.78 v82.39,22.09 | C10_SUPERCAP.1 102.19,62.67 97.9,58.38 96.38,58.38 C8.2 96.31,58.38 95.69,59 90.35,59 | 90.35,59 88.14,59 84.67,62.46 84.67,62.81 U3.13 84.61,62.88 84.61,63.23 83.77,64.06 v83.77,64.26 | 93.82,37.53 93.12,37.53 SENSOR2.1 | 93.82,37.53 96.72,37.53 97.9,38.71 98.11,38.71 C1.2 98.18,38.78 98.18,39.33 112.03,53.18 112.03,59.62 U1.4 112.1,59.69 114.17,59.69 115.97,61.49 U1.9 116.05,61.49 120.27,61.49 124.08,57.69 124.08,39.47
  Top 0.15: 85.96,40.68 89.87,36.77 90.14,36.77 SENSOR2.7 89.87,36.7 89.45,36.29 89.45,35.59 89.94,35.11 90.14,35.11 SENSOR2.5 90.22,35.04 90.63,34.62 | 85.96,40.68 84.81,41.83 C2.2 | 93.82,37.53 93.82,34.76 93.68,34.62 90.63,34.62 | 90.35,59 90.35,44.46 88.48,42.59 87.86,42.59 85.96,40.68 | 90.63,34.62 90.63,23.96
  Bottom 0.15: v36.34,12.88 v36.34,24.24 | v8.36,47.3 v12.03,50.97 | v65.84,103.6 65.84,97.57 v65.91,97.57 v65.91,87.53 65.98,87.53 71.38,82.13 v76.5,82.13 76.5,74.51 83.77,67.24 v83.77,64.26 | v82.39,22.09 83.36,21.12 83.36,20.77 83.15,20.57 v83.15,14.4 82.04,13.3 v79.27,13.3 79.06,13.3 v69.86,4.09 69.79,4.09 65.01,8.86 v64.52,8.86
  pour Top: 76.26,10.06 76.28,10.08 94.52,10.08 94.54,10.06 94.56,10.04 94.58,10.02 94.58,0.08 170.22,0.08 170.22,67.32 92.18,67.32 92.16,67.34 92.14,67.36 92.12,67.38 92.12,111.12 69.08,111.12 69.08,110.48 69.06,110.46 69.04,110.44 69.02,110.42 19.48,110.42 19.46,110.44 19.44,110.46 19.42,110.48 19.42,111.12 0.08,111.12 0.08,64.18 6.52,64.18 6.54,64.16 6.56,64.14 6.58,64.12 6.58,44.38 6.56,44.36 6.54,44.34 6.52,44.32 0.38,44.32 0.38,0.08 76.22,0.08 76.22,10.02 76.24,10.04
  pour Bottom: 76.26,10.06 76.28,10.08 94.52,10.08 94.54,10.06 94.56,10.04 94.58,10.02 94.58,0.08 170.22,0.08 170.22,67.32 92.18,67.32 92.16,67.34 92.14,67.36 92.12,67.38 92.12,111.12 69.08,111.12 69.08,110.48 69.06,110.46 69.04,110.44 69.02,110.42 19.48,110.42 19.46,110.44 19.44,110.46 19.42,110.48 19.42,111.12 0.08,111.12 0.08,64.18 6.52,64.18 6.54,64.16 6.56,64.14 6.58,64.12 6.58,44.38 6.56,44.36 6.54,44.34 6.52,44.32 0.38,44.32 0.38,0.08 76.22,0.08 76.22,10.02 76.24,10.04
GPIO8
  Top 0.15: R1.2 9.89,31.86 9.89,32.89 19.72,42.73 19.72,45.7 U2.10
I2C_PW  (via drill 0.3)
  Top 0.3: 95.69,39.89 95.69,42.03 R1_PINH.2 | 95.69,39.89 96.79,38.78 C1.1 | 90.98,36.7 90.98,37.05 90.56,37.46 90.22,37.46 SENSOR2.8 90.14,37.67 90.14,41.27 89.66,41.76 R2_PINH.2 89.52,41.9 89.24,42.17 v89.24,42.73 | 90.98,36.7 90.98,36.36 90.56,35.94 90.22,35.94 SENSOR2.6 | 90.98,36.7 92.29,36.7 | 92.29,36.7 93.05,36.7 SENSOR2.2 | 92.29,36.7 92.29,37.88 94.23,39.82 95.55,39.82 95.69,39.89 | v87.38,42.73 84.47,42.73 83.64,41.9 83.5,41.9 C2.1 83.36,41.76 81.07,39.47 v65.35,39.47 | v35.85,42.87 22.14,56.58 22.14,63.29 U2.17
  Bottom 0.3: v89.24,42.73 v87.38,42.73 | v35.85,42.87 33.64,42.87 33.57,42.94 33.15,42.94 32.81,42.59 32.81,42.17 34.47,40.51 64.31,40.51 v65.35,39.47
INT_RTC  (via drill 0.3)
  Top 0.15: v83.15,67.24 83.22,67.24 83.84,67.86 R1_PINH1.1 | v83.15,54.98 83.15,53.74 83.29,53.6 U3.3 | v21.45,50.21 17.29,46.05 17.29,45.77 U2.8 | v78.65,55.33 v76.99,53.67 | v140.35,43.77 140.35,15.58 147,8.93 147,4.5 TP15.TP
  Bottom 0.15: v83.15,54.98 83.15,55.33 | 83.15,55.33 83.15,63.78 | 83.15,63.78 v83.15,67.24 | v21.45,50.21 68.54,50.21 72,53.67 v76.99,53.67 | 83.15,55.33 v78.65,55.33 | v140.35,43.77 117.01,67.1 87.24,67.1 83.91,63.78 83.15,63.78
IO/BOOT
  Top 0.15: C6.1 53.1,107.68 52.06,107.68 50.81,108.93 BOOT_BUTTON.3 50.74,108.86 47.35,108.86 BOOT_BUTTON.4 47.28,108.93 46.86,109.35 43.68,109.35 43.4,109.07 28.51,109.07 | 28.51,109.07 R_BOOT.2 | 28.51,109.07 28.51,107.34 24.7,103.53 24.7,63.36 U2.15
IO/CHANGE  (via drill 0.3)
  Top 0.15: CHANGE_BUTTON.4 62.31,108.86 v63.42,108.86 65.77,108.86 CHANGE_BUTTON.3 | v21.24,108.86 20.2,108.86 R_CHANGE.2 | v43.82,108.86 44.58,108.86 44.65,108.79 C10.1 | v14.52,75.62 14.52,63.23 U2.23
  Bottom 0.15: v14.52,75.62 14.52,102.08 21.24,108.79 v21.24,108.86 v43.82,108.86 v63.42,108.86
MISO  (via drill 0.3)
  Top 0.15: v7.46,92.45 6.08,93.83 5.94,93.83 J4.P7 | v12.86,77.84 13.83,76.87 TP6.TP 13.76,76.73 9.47,72.44 9.47,63.16 U2.27 9.47,63.09 9.47,62.81 24.98,47.3 v27.2,47.3 | v64.25,5.89 43.89,5.89 41.19,8.59 41.19,9.07 R8.1 | v65.28,4.85 66.05,4.09 D12.1 | v110.23,60.39 112.03,62.19 U1.2 | v82.8,51.04 72.28,51.04 64.14,42.9 | 64.14,42.9 63.62,42.38 v63.62,20.01 | 64.14,42.9 v63.69,43.35
  Bottom 0.15: v7.46,92.45 7.46,89.19 12.86,83.79 v12.86,77.84 | v65.28,4.85 v64.25,5.89 64.25,5.96 63.62,6.58 v63.62,20.01 | v110.23,60.39 92.15,60.39 v82.8,51.04 | v27.2,47.3 31.14,43.35 v63.69,43.35
MOSI  (via drill 0.3)
  Top 0.15: v10.44,61.22 15.91,55.75 15.91,45.77 U2.7 15.98,45.7 15.98,45.5 v18.89,42.59 | v10.44,75.48 10.44,76.66 10.23,76.87 TP7.TP | v10.44,85.59 6.63,89.4 5.94,89.4 J4.P3 | 84.67,17.59 84.67,19.11 v82.87,20.91 | 84.67,17.59 84.67,15.51 J1.14 | v44.86,4.09 44.23,3.46 R7.1 | v92.71,19.25 119.85,46.4 119.85,59.62 U1.5 | v84.74,17.59 84.67,17.59 | v40.42,8.59 40.22,8.38 35.99,8.38 35.37,9 35.09,9 D11.1
  Bottom 0.15: v10.44,61.22 v10.44,75.48 v10.44,85.59 | v82.87,20.91 73.25,20.91 71.24,22.92 57.74,22.92 46.97,12.15 | 46.97,12.15 45.48,10.66 45.48,8.59 | 45.48,8.59 45.48,4.57 44.99,4.09 v44.86,4.09 | v92.71,19.25 87.38,19.25 85.71,17.59 v84.74,17.59 | 45.48,8.59 v40.42,8.59 | v18.89,42.59 19.03,42.59 45.2,16.41 45.2,13.92 46.97,12.15
N$1
  Top 0.15: R2-USB1.2 152.89,55.26 159.53,55.26 161.75,53.05 162.24,53.05 J2.A5
N$2
  Top 0.15: R2-USB.1 150.46,51.18 150.46,52.28 152.26,54.08 152.26,55.82 152.4,55.95 162.24,55.95 J2.B5
N$3
  Top 0.15: C4.1 60.02,86.15 60.23,86.15 63.28,83.1 71.1,83.1 72,82.2 D4.1 72.07,82.2 72.69,82.82 78.72,82.82 79.41,82.13 81.63,82.13 D3.2
N$4
  Top 0.15: J1.24 79.69,15.51 79.69,18.42 76.3,21.81 EPD_C12.1
N$5
  Top 0.15: J1.5 89.18,15.51 89.18,18.42 EPD_C2.1
N$6  (via drill 0.3)
  Top 0.15: v80.66,16.27 80.66,15.51 J1.22 | v65.98,22.44 64.25,24.17 EPD_C10.1
  Bottom 0.15: v80.66,16.27 72.14,16.27 v65.98,22.44
N$7
  Top 0.15: J1.4 89.66,15.51 89.66,21.33 EPD_C1.1
N$8
  Top 0.15: J1.20 81.63,15.44 81.63,14.96 80.87,14.2 80.1,14.2 74.08,20.22 74.08,21.88 EPD_C8.1
N$9
  Top 0.15: J1.18 82.67,15.51 82.67,19.8 81,21.47 EPD_C6.1
N$10
  Top 0.15: J1.19 82.18,15.51 82.18,17.94 78.58,21.54 EPD_C7.1
N$11
  Top 0.15: R_CAPACITOR.2 102.13,55.19 102.13,56.3 103.99,58.17 D7.1
N$12
  Top 0.15: R2_BAT.2 6.15,18.21 8.08,18.21 15.77,10.53 MCP73831.5
N$13
  Top 0.15: IC4.3 124.56,36.98 120.89,33.31 120.89,33.03 D2.1 120.96,32.96 122.14,31.79 122.14,28.74 123.59,27.29 123.59,22.09 Q1.2 | C1_BAT1.1 129,34.42 127.19,34.42 124.63,36.98 IC4.3 | IC4.1 124.63,38.92 125.05,38.5 125.12,38.5 125.32,38.3 125.32,37.6 124.7,36.98 IC4.3
N$15
  Top 0.15: CHG_LED.C 15.43,20.15 10.99,20.15 R1_BAT.2
N$16
  Top 0.15: R1_BAT.1 9.68,20.08 9.68,17.87 16.33,11.22 16.33,8.66 15.84,8.17 MCP73831.1
N$17
  Top 0.15: IC1.5 67.08,101.17 67.08,106.23 68.47,107.61 C_DELAY.1
PREVGH  (via drill 0.3)
  Top 0.15: v80.66,16.9 81.14,16.41 81.14,15.51 J1.21 | v72.14,16.9 68.19,16.9 64.45,20.64 EPD_C9.1 64.66,20.36 63.83,19.53 63.48,19.53 63.14,19.88 63.14,43.42 65.84,46.12 65.84,82.13 D5.1
  Bottom 0.15: v72.14,16.9 v80.66,16.9
PREVGL  (via drill 0.3)
  Top 0.15: v91.39,23.48 82.87,23.48 | 82.87,23.48 77.96,23.48 77.82,23.34 77.82,21.19 80.17,18.84 80.17,15.51 J1.23 | v92.57,22.3 93.26,21.61 EPD_C11.1 | v70.13,62.19 70.13,79.64 70.34,79.84 70.96,79.84 73.25,82.13 75.46,82.13 D4.2 | v82.87,23.55 82.87,23.48
  Bottom 0.15: v92.57,22.3 v91.39,23.48 | v70.13,62.19 70.13,61.98 83.01,49.1 83.01,23.68 v82.87,23.55
RESE'
  Top 0.15: R2.2 37.72,25.35 37.72,29.29 37.86,29.43 SJ1.2 37.93,31.72 59.95,53.74 59.95,81.72 Q3.2 59.95,81.78 59.95,81.99 58.43,83.52 58.43,87.39 59.33,88.29 70.13,88.29 71.66,86.77 R3.1 71.72,86.7 72.97,86.7 R3.2
RESET  (via drill 0.3)
  Top 0.15: RESET_BUTTON.4 22.35,108.86 25.74,108.86 RESET_BUTTON.3 25.81,108.93 26.57,108.93 27.27,109.62 59.81,109.62 60.37,109.07 R_RESET.2 60.44,109.07 60.99,109.07 61.55,109.62 68.95,109.62 69.16,109.42 69.16,108.44 68.95,108.24 67.98,108.24 66.74,106.99 66.74,103.88 64.18,101.31 IC1.1 64.25,101.17 64.18,101.24 v63.42,101.24 | v56.56,101.24 56.56,101.17 55.94,100.55 C5.1 | v10.92,50.48 10.92,45.7 U2.3
  Bottom 0.15: v63.42,101.24 v56.56,101.24 50.05,101.24 10.92,62.12 v10.92,50.48
RTC_RST  (via drill 0.3)
  Top 0.15: v36.68,42.87 23.18,56.37 23.18,57.41 23.32,57.55 23.32,63.29 U2.16 | v79.2,42.87 79.41,42.87 84.61,48.06 84.61,53.53 U3.4
  Bottom 0.15: v79.2,42.87 v36.68,42.87
RX  (via drill 0.3)
  Top 0.15: v35.58,41.9 30.18,47.3 28.86,47.3 13.28,62.88 13.28,63.16 U2.24 | v83.01,22.09 84.19,22.09 85.09,21.19 85.09,17.87 v86.61,16.34 | v147.14,9.42 147.9,9.42 148.38,8.93 TP2.TP
  Bottom 0.15: v35.58,41.9 63.97,41.9 82.39,23.48 82.39,22.71 v83.01,22.09 | v86.61,16.34 86.75,16.2 86.75,16.14 91.67,11.22 116.81,11.22 118.61,9.42 v147.14,9.42
SCK  (via drill 0.3)
  Top 0.15: v10.09,52.28 14.66,47.71 14.66,45.7 U2.6 14.73,45.64 14.73,45.43 v18.26,41.9 | v3.31,75.62 2.41,76.52 TP8.TP 2.34,76.66 0.4,78.6 0.4,86.7 5.31,91.62 5.87,91.62 J4.P5 | v82.18,14.06 82.39,13.85 84.33,13.85 85.16,14.68 85.16,15.44 J1.13 85.23,15.51 85.23,15.93 v85.58,16.27 | v59.19,3.74 54.9,3.74 54.07,4.57 49.84,4.57 48.94,3.67 R6.1 | v91.6,18.77 108.5,35.66 108.5,49.24 119.85,60.59 119.85,60.87 U1.6 | 45.38,12.43 46.17,13.23 57.25,13.23 v57.32,13.16 | 45.38,12.43 45.06,12.12 44.86,12.12 D10.1 | 45.38,12.43 v44.65,13.16
  Bottom 0.15: v10.09,52.28 6.91,55.47 6.91,72.02 v3.31,75.62 | v82.18,14.06 69.09,14.06 64.04,9 64.04,6.72 65.77,4.99 65.77,4.71 64.8,3.74 60.16,3.74 | v59.19,3.74 60.16,3.74 | v91.6,18.77 88.07,18.77 v85.58,16.27 | v57.32,13.16 57.53,13.16 57.6,13.23 57.88,13.23 60.16,10.94 60.16,3.74 | v18.26,41.9 19.3,41.9 44.65,16.55 v44.65,13.16
SCL  (via drill 0.3)
  Top 0.15: v35.99,58.31 35.3,58.31 U4.7 | v19.72,61.56 18.33,62.95 18.33,63.23 U2.20 | v88.27,39.47 88.27,41.83 R2_PINH.1 | v92.22,35.52 92.43,35.52 92.78,35.18 93.05,35.18 SENSOR2.4 | v148.59,20.84 164.52,20.84 J3.4 | v80.87,61.42 80.87,62.81 U3.16 | v82.67,59.62 82.67,58.38 86.41,54.64 v86.41,44.18 | v77.54,58.31 v72.35,58.31
  Bottom 0.15: v19.72,61.56 22.97,58.31 v35.99,58.31 v72.35,58.31 | v148.59,20.84 139.8,12.05 116.39,12.05 92.91,35.52 v92.22,35.52 v88.27,39.47 88.27,39.54 86.41,41.41 v86.41,44.18 | v82.67,59.62 v80.87,61.42 80.8,61.42 77.68,58.31 v77.54,58.31
SDA  (via drill 0.3)
  Top 0.15: v21.03,61.56 19.58,63.02 19.58,63.23 U2.19 | U4.8 35.23,58.79 v32.46,61.56 32.46,61.98 30.18,64.26 30.18,64.54 40.01,74.37 v59.47,74.37 | v92.22,39.89 94.37,42.03 R1_PINH.1 94.44,42.1 105.38,53.05 105.38,63.57 105.24,63.71 91.88,63.71 89.04,66.55 89.04,67.52 88.76,67.8 87.93,67.8 87.65,67.52 85.99,67.52 82.11,63.64 82.11,62.88 U3.15 82.04,63.64 v81.56,64.13 | v92.22,36.15 92.85,36.15 93.05,35.94 SENSOR2.3 | v140.84,17.17 143.54,19.88 J3.3
  Bottom 0.15: v21.03,61.56 v32.46,61.56 | v92.22,39.89 v92.22,36.15 92.71,36.15 116.53,12.33 120.41,12.33 125.25,17.17 v140.84,17.17 | v59.47,74.37 71.31,74.37 v81.56,64.13
SRC
  Top 0.15: C4.2 61.27,86.22 61.06,86.22 60.37,86.91 59.61,86.91 59.4,86.7 59.4,85.04 62.03,82.41 Q3.3 62.1,82.41 64.8,82.41 65.22,82.82 68.54,82.82 69.23,82.13 D5.2 69.3,82.13 69.3,78.88 67.43,77.01 L1.1
SS_SD  (via drill 0.3)
  Top 0.15: v59.67,4.78 59.67,2.42 R10.1 | v57.74,12.74 58.08,12.74 58.57,13.23 D8.1 | v9.33,33.38 12.1,36.15 12.1,45.64 U2.4 | v7.39,87.25 6.35,88.29 J4.P2 | v7.39,47.85 v7.39,55.61
  Bottom 0.15: v57.74,12.74 59.67,10.8 v59.67,4.78 59.61,4.78 57.94,3.12 39.8,3.12 9.54,33.38 v9.33,33.38 9.33,33.45 7.39,35.39 v7.39,47.85 | v7.39,55.61 v7.39,87.25
TX  (via drill 0.3)
  Top 0.15: v12.86,62.05 11.96,62.95 11.96,63.16 U2.25 | v82.53,44.94 83.15,44.94 84.4,43.7 88.97,43.7 v89.59,44.32 | v144.78,17.66 153.51,8.93 TP1.TP
  Bottom 0.15: v12.86,62.05 21.73,62.05 22.28,62.6 69.09,62.6 82.53,49.17 v82.53,44.94 | v89.59,44.32 112.03,44.32 138.69,17.66 v144.78,17.66
USB_D+  (via drill 0.3)
  Top 0.15: v121.52,61.56 145.82,61.56 D1.2 | v75.95,51.52 v79.13,54.71 | v25.67,46.6 24.91,45.84 U2.14
  Bottom 0.15: v121.52,61.56 90.35,61.56 83.29,54.5 79.34,54.5 v79.13,54.71 | v75.95,51.52 70.27,51.52 66.53,47.78 26.85,47.78 v25.67,46.6
USB_D-  (via drill 0.3)
  Top 0.15: v123.38,59.69 145.82,59.69 D1.4 | v72.28,50.41 v83.43,50.41 | v27.82,47.3 25.33,44.8 24.36,44.8 23.6,45.57 23.6,45.77 U2.13
  Bottom 0.15: v123.38,59.69 120.82,59.69 108.15,47.02 86.82,47.02 v83.43,50.41 | v72.28,50.41 69.58,50.41 66.46,47.3 v27.82,47.3
VBAT  (via drill 0.3)
  Top 0.3: v123.11,23.34 122.69,23.75 122.69,24.1 Q1.3 122.55,24.24 102.54,24.24 100.6,26.18 100.19,26.18 93.26,19.25 v93.26,14.68 | v134.6,17.66 143.33,8.93 TP3.TP | U4.2 33.29,58.24 33.29,57.82 U4.3 33.15,57.76 v23.8,57.76 | v7.88,46.74 7.81,46.74 7.05,45.98 7.05,42.66 3.72,39.33 3.72,11.15 C2_BAT.1 3.65,11.01 8.02,6.65 16.81,6.65 17.71,7.55 17.71,7.83 MCP73831.3 17.85,7.48 20,5.33 64.52,5.33 69.65,10.46 77.19,10.46 79.2,12.46 v91.05,12.46
  Bottom 0.3: v123.11,23.34 128.93,23.34 v134.6,17.66 | v23.8,57.76 19.58,57.76 8.57,46.74 v7.88,46.74 | v91.05,12.46 v93.26,14.68
VBUS  (via drill 0.3)
  Top 0.3: D1.6 148.31,60.66 147.97,60.66 146.79,59.49 146.79,59.28 142.91,55.4 C4_USB.1 142.78,55.33 142.64,55.19 142.64,50 C5_USB.1 142.5,49.93 v128.72,36.15 | CHG_LED.A 17.02,20.08 17.02,16.9 18.26,15.65 C1_BAT.1 18.19,15.51 17.78,15.1 17.78,14.13 | 17.78,14.13 17.78,10.53 MCP73831.4 | 124.15,21.33 123.04,21.33 122.35,22.02 121.72,22.02 Q1.1 121.58,22.09 v105.73,22.09 | 124.15,21.33 124.36,21.54 124.36,27.63 122.9,29.09 R1_PWRUSB.2 122.97,29.22 122.97,32.96 D2.2 123.11,33.03 v123.73,33.66 | TP14.TP 153.37,4.43 149.42,4.43 147.69,2.7 136.89,2.7 124.22,15.37 124.22,21.19 124.15,21.33 | v19.09,14.13 17.78,14.13 | v48.32,14.13 v24.5,14.13 | v81.28,23.96 82.53,23.96 83.01,24.45 v87.38,24.45
  Bottom 0.3: v24.5,14.13 v19.09,14.13 | v48.32,14.13 58.15,23.96 v81.28,23.96 | v87.38,24.45 88.14,25.21 102.61,25.21 v105.73,22.09 | v128.72,36.15 126.22,36.15 v123.73,33.66
VRTC  (via drill 0.3)
  Top 0.3: C10_SUPERCAP.2 104.41,62.67 104.41,59.83 100.81,56.23 100.81,55.33 R_CAPACITOR.1 100.74,55.19 98.18,55.19 95.06,58.31 C8.1 94.92,58.24 v94.16,57.48 | v89.87,57.48 88.27,57.48 83.36,62.39 83.36,62.81 U3.14
  Bottom 0.3: v94.16,57.48 v89.87,57.48
VUSB  (via drill 0.3)
  Top 0.3: J2.A4 162.3,51.73 J2.B9 162.44,52.08 163,52.08 v163.27,52.35 | J2.A9 162.3,56.78 162.3,56.58 J2.B4 162.44,56.44 163,56.44 v163.27,56.16 | v146.72,46.12 145.62,45.01 PFMF.050.1.1
  Bottom 0.3: v163.27,56.16 v163.27,52.35 163.14,52.28 152.89,52.28 v146.72,46.12